# Altium schematic sheet RelayBoard.SchDoc
size A
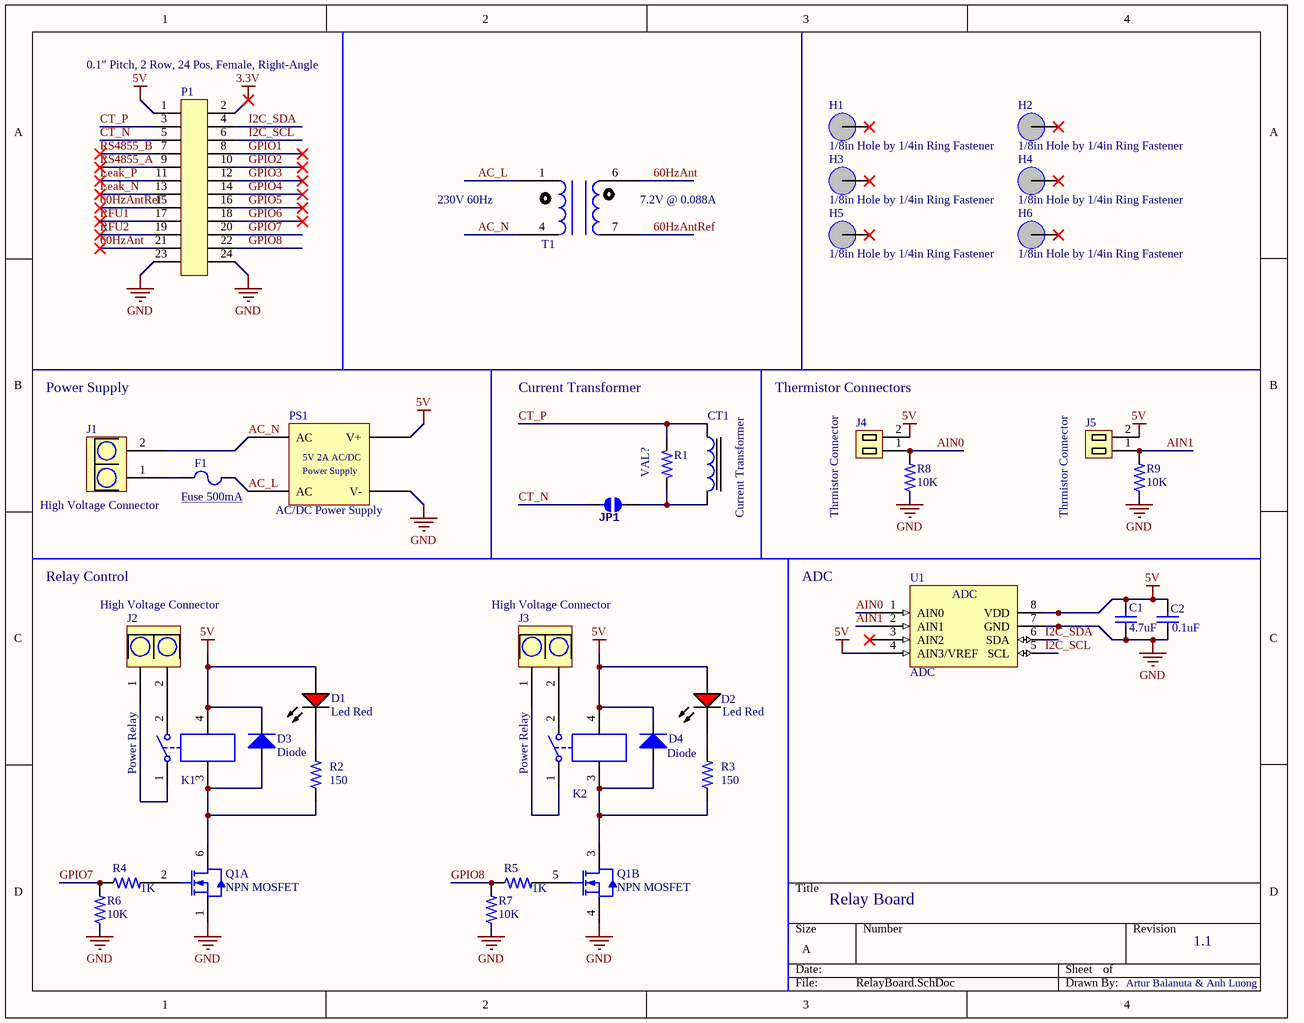
[diagram p0: RelayBoard.SchDoc]

## Parts
C1  4.7uF  [CAPC1608X09L - CAP0603]
C2  0.1uF  [CAPC1608X09L - CAP0603]
CT1  Current Transformer  [CT-CR8348]
D1  Led Red  [LED-0603 .7MM TALL]
D2  Led Red  [LED-0603 .7MM TALL]
D3  Diode  [SOD-80  MiniMELF]
D4  Diode  [SOD-80  MiniMELF]
F1  Fuse 500mA  [FUSE M10742X40L Schurter UMK 250 Series]
H1  1/8in Hole by 1/4in Ring Fastener  [1/8in Fastener Hole]
H2  1/8in Hole by 1/4in Ring Fastener  [1/8in Fastener Hole]
H3  1/8in Hole by 1/4in Ring Fastener  [1/8in Fastener Hole]
H4  1/8in Hole by 1/4in Ring Fastener  [1/8in Fastener Hole]
H5  1/8in Hole by 1/4in Ring Fastener  [1/8in Fastener Hole]
H6  1/8in Hole by 1/4in Ring Fastener  [1/8in Fastener Hole]
J1  High Voltage Connector  [2POS Barrier Block Terminal]
J2  High Voltage Connector  [2POS Barrier Block Terminal]
J3  High Voltage Connector  [2POS Barrier Block Terminal]
J4  Thrmistor Connector  [2POS JST B02P-VL]
J5  Thrmistor Connector  [2POS JST B02P-VL]
JP1  JUMPER-PAD-2-NO  [PAD-JUMPER-2-NO_NO_SILK]  (value not drawn)
K1  Power Relay  [T9AS1D12-5]
K2  Power Relay  [T9AS1D12-5]
P1  0.1" Pitch, 2 Row, 24 Pos, Female, Right-Angle  [0.1 inch 2 row 24 pos female right-angle header Sullins]
PS1  AC/DC Power Supply  [IRM-10-5]
Q1  NPN MOSFET  [SC-70-6  (SOT-363)]  (parts A,B of 2)
R1  VAL?  [RESC1608X06L - RES0603]
R2  150  [RESC1608X06L - RES0603]
R3  150  [RESC1608X06L - RES0603]
R4  1K  [RESC1608X06L - RES0603]
R5  1K  [RESC1608X06L - RES0603]
R6  10K  [RESC1608X06L - RES0603]
R7  10K  [RESC1608X06L - RES0603]
R8  10K  [RESC1608X06L - RES0603]
R9  10K  [RESC1608X06L - RES0603]
T1  SPK00304  [SPK003]  (value not drawn)
U1  ADC  [8L uMAX/uSOP TSOP65P490X110-8L]

## Nets
3.3V: P1.2
5V: C1.2 C2.2 D1.A D2.A D3.1(K) D4.1(K) J4.2 J5.2 K1.4 K2.4 P1.1 PS1.V+ U1.4(AIN3/VREF) U1.8(VDD)
GND: C1.1 C2.1 P1.23 P1.24 PS1.V- Q1.1(S1) Q1.4(S2) R6.1 R7.1 R8.1 R9.1 U1.7(GND)
60HzAnt: P1.21 T1.6
60HzAntRef: P1.15 T1.7
AC_L: F1.2 PS1.AC1(AC) T1.1
AC_N: J1.2 PS1.AC2(AC) T1.4
AIN0: J4.1 R8.2 U1.1(AIN0)
AIN1: J5.1 R9.2 U1.2(AIN1)
CT_N: JP1.1 P1.5
CT_P: CT1.1 P1.3 R1.2
GPIO1: P1.8
GPIO2: P1.10
GPIO3: P1.12
GPIO4: P1.14
GPIO5: P1.16
GPIO6: P1.18
GPIO7: P1.20 R4.1 R6.2
GPIO8: P1.22 R5.1 R7.2
I2C_SCL: P1.6 U1.5(SCL)
I2C_SDA: P1.4 U1.6(SDA)
Leak_N: P1.13
Leak_P: P1.11
RFU1: P1.17
RFU2: P1.19
RS4855_A: P1.9
RS4855_B: P1.7
NetCT1_2: CT1.2 JP1.2 R1.1
NetD1_K: D1.K R2.2
NetD2_K: D2.K R3.2
NetD3_2: D3.2(A) K1.3 Q1.6(D1) R2.1
NetD4_2: D4.2(A) K2.3 Q1.3(D2) R3.1
NetF1_1: F1.1 J1.1
NetJ2_1: J2.1 K1.1
NetJ2_2: J2.2 K1.2
NetJ3_1: J3.1 K2.1
NetJ3_2: J3.2 K2.2
NetQ1_2: Q1.2(G1) R4.2
NetQ1_5: Q1.5(G2) R5.2

Not connected (* = marked no-connect by the designer): H1 1*; H2 1*; H3 1*; H4 1*; H5 1*; H6 1*; U1 3(AIN2)*

## Notes on the sheet
- 230V 60Hz
- (near T1) 7.2V @ 0.088A
- Power Supply
- Current Transformer
- (near J4) Thermistor Connectors
- Relay Control
- ADC
- Relay Board
- 1.1
- Artur Balanuta & Anh Luong
- (in symbol IRM-10-5) 5V 2A AC/DC; Power Supply

## Library data of the parts
C1 = CAP0603 4.7uF 10% 6.3V X7R: SMT 0603 Ceramic Capacitor; TempCoeff: X7R; Tolerance: 10%; Voltage: 6.3V; Value: 4.7uF; Supplier 1: Digi-Key; Supplier Part Number 1: 1276-2087-1-ND
C2 = CAP0603 0.1uF 10% 25V X7R: SMT 0603 Ceramic Capacitor; TempCoeff: X7R; Tolerance: 10%; Voltage: 25V; Value: 0.1uF; Supplier 1: Digi-Key; Supplier 2: Digi-Key; Supplier Part Number 1: 311-1341-1-ND; Supplier Part Number 2: 490-1524-1-ND
CT1 = CT CR8348-2000: TRANSF CURRENT .27" OPENING PCB 50A; url: https://www.digikey.com/product-detail/en/cr-magnetics-inc/CR8348-2000/582-1010-ND/1045166; Supplier 1: Digi-Key; Supplier Part Number 1: 582-1010-ND
D1 D2 = LED0603 RED 20mA 250mcd: LED RED CLEAR 0603 SMD 250 mcd; Supplier 1: Digi-Key; Supplier Part Number 1: 732-4978-1-ND
D3 D4 = Diode LL4150GS18: DIODE GEN 50V 600MA MINI MELF; Supplier 1: Digi-Key; Supplier Part Number 1: LL4150GS18GICT-ND
F1 = FUSE-Schurter-3404.2463.22: FUSE UMK 250 FUSE WITH HOLDER 500MA F; URL: https://www.digikey.com/product-detail/en/3404.2463.22/486-3187-1-ND/5225261?curr=usd&WT.z_cid=ref_octopart_dkc_buynow&site=us; Supplier 1: Digi-Key; Supplier Part Number 1: 486-3187-1-ND
H1-H6 = 1/8in by 1/4in Fastner Hole
J1-J3 = 2POS CONN BARRIER STRIP 2CIRC 0.5" 45A 600V: MOLEX  0386608802; URL: http://www.mouser.com/ProductDetail/Molex/38660-8802/?qs=sGAEpiMZZMsntO7gZZwOWBznzzIjRi3IH61qEmgvOKA%3d; Supplier 1: Digi-Key; Supplier Part Number 1: WM4395-ND
J4 J5 = 2POS Thermistor Connector B02P-VL: JST B02P-VL CONN HEADER 2POS VL SERIES TIN; Supplier 1: Digi-Key; Supplier Part Number 1: 455-2361-ND; URL: https://www.digikey.com/products/en?mpart=B02P-VL&v=455
K1 K2 = T9AS1D12-5: Single-Pole Single-Throw Relay; Supplier 1: Digi-Key; Supplier Part Number 1: PB1014-ND; Part Number: T9AS1D12-5
P1 = 0.1" 2 row 24 position female right-angle header sullins: Sullins 0.1" 2 row 24 position female right-angle header; Rows: 2; Positions: 24; Pitch: 2.54mm; Supplier 1: Digi-Key; Supplier 2: Digi-Key; Supplier Part Number 1: S5526-ND; Supplier Part Number 2: S5565-ND
PS1 = IRM-10-5: AC/DC Power Modules 5V 2A 10W 85-264Vin Encap PS; Supplier 1: Allied; Supplier Part Number 1: 70387823; Mouser Link: http://www.mouser.com/ProductDetail/Mean-Well/IRM-10-5/?qs=sGAEpiMZZMuWiaalG5TUgH52QN1%252bIKAVGLeN4i9HrWU2QI8q%2fOO4Cw%3d%3d; Supplier 2: Mouser; Supplier Part Number 2: Anonymous Daily Limit Reached
Q1 = SI1922EDH-T1-GE3CT: 2N-CH NPN MOSFET 20V 1.3A SOT-363; Supplier 1: Digi-Key; Supplier Part Number 1: SI1922EDH-T1-GE3CT-ND
R1 = RES0603: SMT 0603 Ceramic Resistor; Value: VAL?
R2 R3 = RES0603 150 1% 1/10W_1: SMT 0603 Ceramic Resistor; Supplier 1: Digi-Key; Supplier Part Number 1: 311-150HRCT-ND; Value: 150
R4 R5 = RES0603 1K 1% 1/10W: SMT 0603 Ceramic Resistor; Power: 1/10W; Tolerance: 1%; Value: 1K; Supplier 1: Digi-Key; Supplier 2: Digi-Key; Supplier 3: Digi-Key; Supplier Part Number 1: 311-1.00KHRCT-ND; Supplier Part Number 2: P1.00KHCT-ND; Supplier Part Number 3: RMCF0603FG1K00CT-ND
R6-R9 = RES0603 10K 1% 1/10W: SMT 0603 Ceramic Resistor; Power: 1/10W; Tolerance: 1%; Supplier 1: Digi-Key; Supplier 2: Digi-Key; Supplier 3: Digi-Key; Supplier Part Number 1: 311-10.0KHRCT-ND; Supplier Part Number 2: RMCF0603FT10K0CT-ND; Supplier Part Number 3: P10.0KHCT-ND; Value: 10K
T1 = SPK00304: Standard PCB-Transformers | SPK-003 | POWER 0.35 VA
U1 = MAX11612EUA+: IC ADC I2C/SRL 12BIT 4CH 8UMAX; URL: https://www.digikey.com/product-detail/en/maxim-integrated/MAX11612EUA-/MAX11612EUA--ND/2061925; Supplier 1: Digi-Key; Supplier Part Number 1: MAX11612EUA+-ND